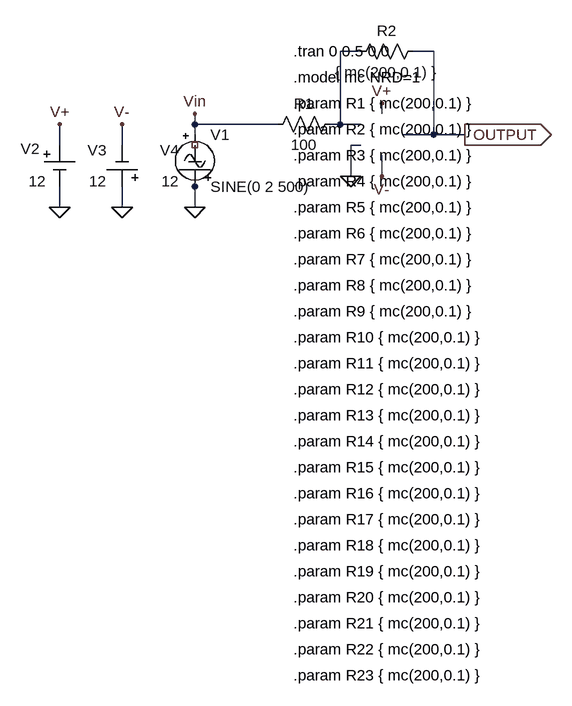
[diagram p0: schematic llamacir.asc]
llamacir.asc, the LTspice schematic file:
Version 4
SHEET 1 880 680
WIRE 144 16 112 16
WIRE 256 16 224 16
WIRE 176 112 176 96
WIRE -112 128 -112 112
WIRE 16 128 -112 128
WIRE 112 128 112 16
WIRE 112 128 96 128
WIRE 144 128 112 128
WIRE -112 144 -112 128
WIRE 256 144 256 16
WIRE 256 144 208 144
WIRE 304 144 256 144
WIRE -320 160 -320 128
WIRE -224 160 -224 128
WIRE 144 160 128 160
WIRE 128 208 128 160
WIRE 176 208 176 176
WIRE -320 256 -320 224
WIRE -224 256 -224 224
WIRE -112 256 -112 224
FLAG -112 256 0
FLAG 128 208 0
FLAG -320 256 0
FLAG -224 256 0
FLAG -320 128 V+
FLAG 176 96 V+
FLAG -224 128 V-
FLAG 176 208 V-
FLAG -112 112 Vin
FLAG 304 144 OUTPUT
IOPIN 304 144 Out
SYMBOL res 112 112 R90
WINDOW 0 0 56 VBottom 2
WINDOW 3 32 56 VTop 2
SYMATTR InstName R1
SYMATTR Value 100
SYMBOL res 240 0 R90
WINDOW 0 0 56 VBottom 2
WINDOW 3 32 56 VTop 2
SYMATTR InstName R2
SYMATTR Value { mc(200,0.1) }
SYMBOL Misc\signal -112 128 R0
WINDOW 123 0 0 Left 0
WINDOW 39 0 0 Left 0
SYMATTR InstName V1
SYMATTR Value SINE(0 2 500)
SYMBOL Misc\cell -320 160 R0
WINDOW 0 -60 6 Left 2
WINDOW 3 -48 56 Left 2
WINDOW 123 0 0 Left 0
WINDOW 39 0 0 Left 0
SYMATTR InstName V2
SYMATTR Value 12
SYMBOL Misc\cell -224 224 R180
WINDOW 0 24 56 Left 2
WINDOW 3 24 8 Left 2
WINDOW 123 0 0 Left 0
WINDOW 39 0 0 Left 0
SYMATTR InstName V3
SYMATTR Value 12
SYMBOL Misc\cell -112 224 R180
WINDOW 0 24 56 Left 2
WINDOW 3 24 8 Left 2
WINDOW 123 0 0 Left 0
WINDOW 39 0 0 Left 0
SYMATTR InstName V4
SYMATTR Value 12
TEXT 40 16 Left 2!.tran 0 0.5 0 0
TEXT 40 56 Left 2!.model mc NRD=1
TEXT 40 96 Left 2!.param R1 { mc(200,0.1) }
TEXT 40 136 Left 2!.param R2 { mc(200,0.1) }
TEXT 40 176 Left 2!.param R3 { mc(200,0.1) }
TEXT 40 216 Left 2!.param R4 { mc(200,0.1) }
TEXT 40 256 Left 2!.param R5 { mc(200,0.1) }
TEXT 40 296 Left 2!.param R6 { mc(200,0.1) }
TEXT 40 336 Left 2!.param R7 { mc(200,0.1) }
TEXT 40 376 Left 2!.param R8 { mc(200,0.1) }
TEXT 40 416 Left 2!.param R9 { mc(200,0.1) }
TEXT 40 456 Left 2!.param R10 { mc(200,0.1) }
TEXT 40 496 Left 2!.param R11 { mc(200,0.1) }
TEXT 40 536 Left 2!.param R12 { mc(200,0.1) }
TEXT 40 576 Left 2!.param R13 { mc(200,0.1) }
TEXT 40 616 Left 2!.param R14 { mc(200,0.1) }
TEXT 40 656 Left 2!.param R15 { mc(200,0.1) }
TEXT 40 696 Left 2!.param R16 { mc(200,0.1) }
TEXT 40 736 Left 2!.param R17 { mc(200,0.1) }
TEXT 40 776 Left 2!.param R18 { mc(200,0.1) }
TEXT 40 816 Left 2!.param R19 { mc(200,0.1) }
TEXT 40 856 Left 2!.param R20 { mc(200,0.1) }
TEXT 40 896 Left 2!.param R21 { mc(200,0.1) }
TEXT 40 936 Left 2!.param R22 { mc(200,0.1) }
TEXT 40 976 Left 2!.param R23 { mc(200,0.1) }

The netlist it stands for:
* llamacir.asc
R1 N001 Vin 100
R2 OUTPUT N001 { mc(200,0.1) }
V1 Vin 0 SINE(0 2 500)
V2 V+ 0 12
V3 0 V- 12
V4 0 NC_01 12
.tran 0 0.5 0 0
.model mc NRD=1
.param R1 { mc(200,0.1) }
.param R2 { mc(200,0.1) }
.param R3 { mc(200,0.1) }
.param R4 { mc(200,0.1) }
.param R5 { mc(200,0.1) }
.param R6 { mc(200,0.1) }
.param R7 { mc(200,0.1) }
.param R8 { mc(200,0.1) }
.param R9 { mc(200,0.1) }
.param R10 { mc(200,0.1) }
.param R11 { mc(200,0.1) }
.param R12 { mc(200,0.1) }
.param R13 { mc(200,0.1) }
.param R14 { mc(200,0.1) }
.param R15 { mc(200,0.1) }
.param R16 { mc(200,0.1) }
.param R17 { mc(200,0.1) }
.param R18 { mc(200,0.1) }
.param R19 { mc(200,0.1) }
.param R20 { mc(200,0.1) }
.param R21 { mc(200,0.1) }
.param R22 { mc(200,0.1) }
.param R23 { mc(200,0.1) }
.backanno
.end